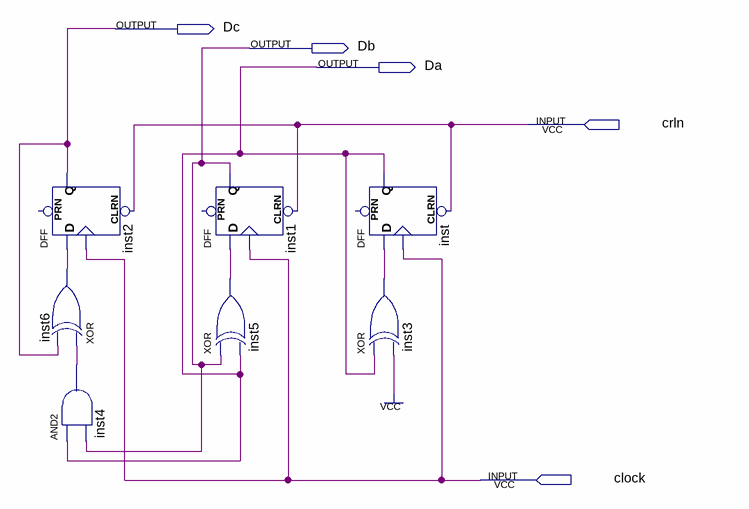
[diagram p0: schematic sheet]
// Quartus schematic DFFU.bdf as structural Verilog: 7 symbols, 5 pins
module DFFU (
  input  crln,
  input  clock,
  output Dc,
  output Db,
  output Da
);

  wire inst3_out, inst4_out, inst5_out, inst6_out;

  DFF inst2 (.CLRN(crln), .CLK(clock), .D(inst6_out), .Q(Dc));  // open: PRN
  xor inst6 (inst6_out, inst4_out, Dc);
  and inst4 (inst4_out, Da, Db);
  DFF inst1 (.CLRN(crln), .CLK(clock), .D(inst5_out), .Q(Db));  // open: PRN
  xor inst5 (inst5_out, Db, Da);
  DFF inst (.CLRN(crln), .CLK(clock), .D(inst3_out), .Q(Da));  // open: PRN
  xor inst3 (inst3_out, Da, 1'b1);
endmodule
